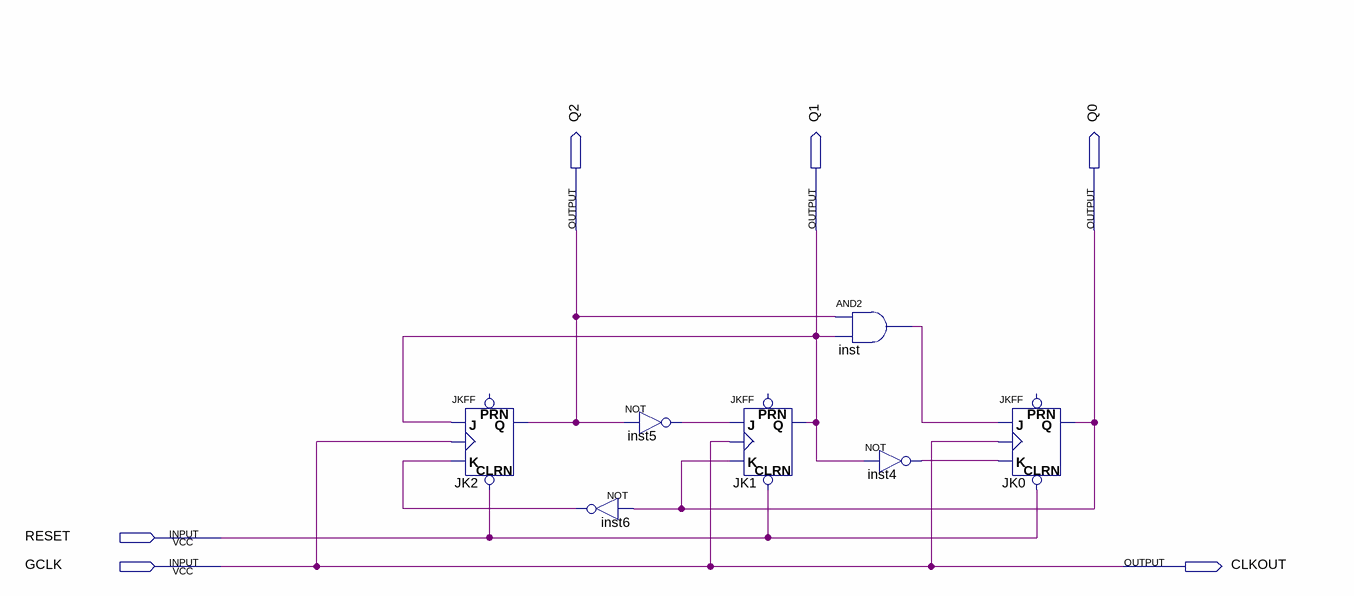
[diagram p0: schematic sheet]
// Quartus schematic lab2a.bdf as structural Verilog: 7 symbols, 6 pins
module lab2a (
  input  RESET,
  input  GCLK,
  output Q2,
  output Q1,
  output Q0,
  output CLKOUT
);

  wire inst4_out, inst5_out, inst6_out, inst_out;

  JKFF JK2 (.CLRN(RESET), .K(inst6_out), .J(Q1), .CLK(GCLK), .Q(Q2));  // open: PRN
  not inst5 (inst5_out, Q2);
  not inst6 (inst6_out, Q0);
  JKFF JK1 (.CLRN(RESET), .K(Q0), .J(inst5_out), .CLK(GCLK), .Q(Q1));  // open: PRN
  and inst (inst_out, Q2, Q1);
  not inst4 (inst4_out, Q1);
  JKFF JK0 (.CLRN(RESET), .K(inst4_out), .J(inst_out), .CLK(GCLK), .Q(Q0));  // open: PRN

  assign CLKOUT = GCLK;
endmodule
